# EAGLE schematic esquemático módulo v16 (EAGLE 9.7.0)
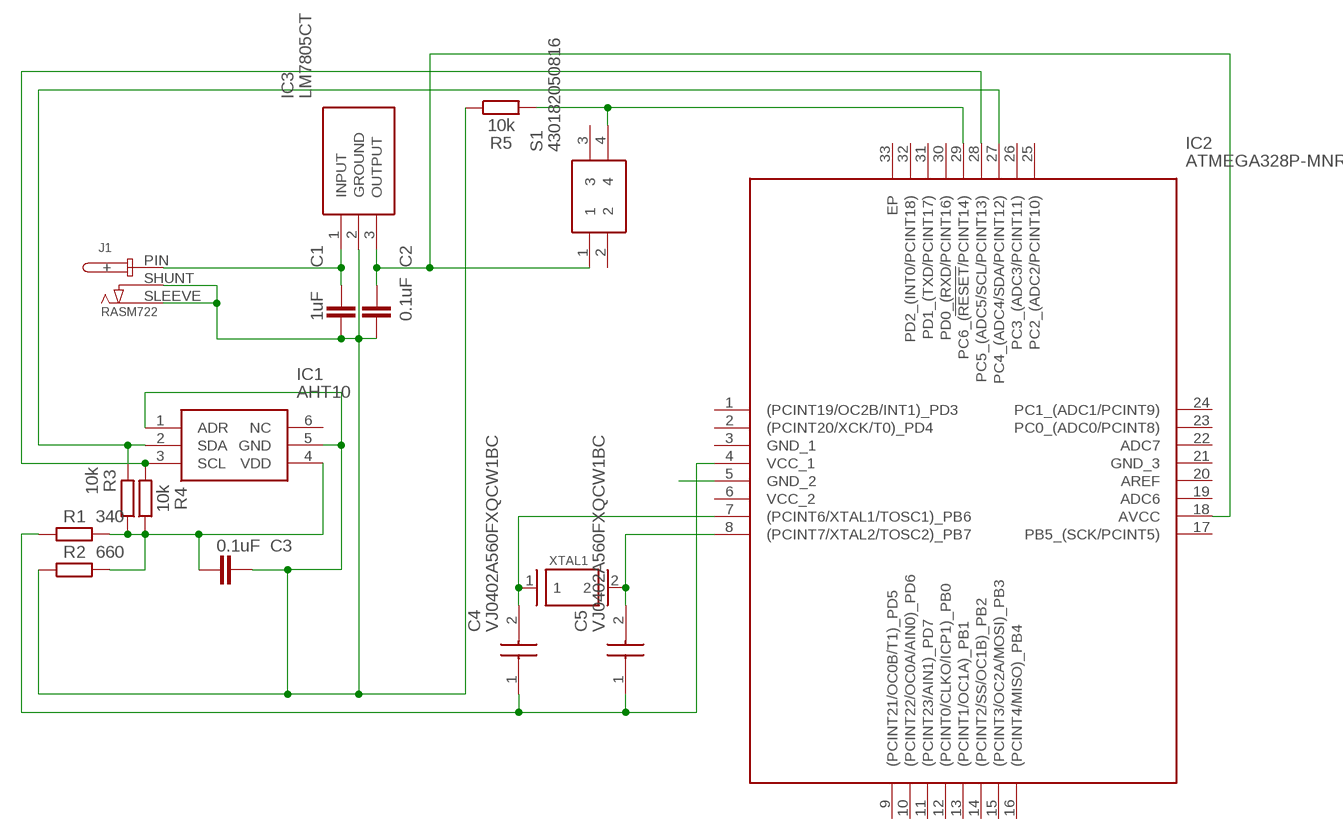
[diagram p0: schematic, sheet 1]

## Parts
C1  1uF  C_CHIP-0402(1005-METRIC)  [CAPC1005X60]
C2  0.1uF  C_CHIP-0402(1005-METRIC)  [CAPC1005X60]
C3  0.1uF  C_CHIP-0402(1005-METRIC)  [CAPC1005X60]
C4  VJ0402A560FXQCW1BC  [CAPC1005X55N]
C5  VJ0402A560FXQCW1BC  [CAPC1005X55N]
IC1  AHT10  [AHT10]
IC2  ATMEGA328P-MNR  [QFN50P500X500X100-33N]
IC3  LM7805CT  [TO254P470X1028X1955-3P]
J1  RASM722  [RASM722X]
R1  340  R_CHIP-2512(6332-METRIC)  [RESC6332X71]
R2  660  R_CHIP-2512(6332-METRIC)  [RESC6332X71]
R3  10k  R_CHIP-2512(6332-METRIC)  [RESC6332X71]
R4  10k  R_CHIP-2512(6332-METRIC)  [RESC6332X71]
R5  10k  R_CHIP-2512(6332-METRIC)  [RESC6332X71]
S1  430182050816  [430182070816]
XTAL1  16MHz  FC4SDFREQUENCY_16MHZ  [XTAL1170X500X450N]

## Nets
GND: C1.2 C2.2 C3.1 IC1.1(ADR) IC1.5(GND) IC3.2(GROUND) J1.SHUNT(-) J1.SLEEVE(NEG) R2.1 R5.1
N$1: IC1.3(SCL) IC2.28(PC5_(ADC5/SCL/PCINT13)) R4.2
N$2: C4.2 IC2.7((PCINT6/XTAL1/TOSC1)_PB6) XTAL1.1
N$3: C3.2 IC1.4(VDD) R1.2 R2.2 R3.1 R4.1
N$4: C5.2 IC2.8((PCINT7/XTAL2/TOSC2)_PB7) XTAL1.2
N$5: C1.1 IC3.1(INPUT) J1.PIN(+)
N$6: IC2.5(GND_2)
N$7: IC1.2(SDA) IC2.27(PC4_(ADC4/SDA/PCINT12)) R3.2
N$9: C2.1 IC2.18(AVCC) IC3.3(OUTPUT) S1.1
N$10: IC2.29(PC6_(!RESET!/PCINT14)) R5.2 S1.4
N$11: C4.1 C5.1 IC2.4(VCC_1) R1.1
Unconnected: IC1.6(NC) IC2.1((PCINT19/OC2B/INT1)_PD3) IC2.2((PCINT20/XCK/T0)_PD4) IC2.3(GND_1) IC2.6(VCC_2) IC2.9((PCINT21/OC0B/T1)_PD5) IC2.10((PCINT22/OC0A/AIN0)_PD6) IC2.11((PCINT23/AIN1)_PD7) IC2.12((PCINT0/CLKO/ICP1)_PB0) IC2.13((PCINT1/OC1A)_PB1) IC2.14((PCINT2/SS/OC1B)_PB2) IC2.15((PCINT3/OC2A/MOSI)_PB3) IC2.16((PCINT4/MISO)_PB4) IC2.17(PB5_(SCK/PCINT5)) IC2.19(ADC6) IC2.20(AREF) IC2.21(GND_3) IC2.22(ADC7) IC2.23(PC0_(ADC0/PCINT8)) IC2.24(PC1_(ADC1/PCINT9)) IC2.25(PC2_(ADC2/PCINT10)) IC2.26(PC3_(ADC3/PCINT11)) IC2.30(PD0_(RXD/PCINT16)) IC2.31(PD1_(TXD/PCINT17)) IC2.32(PD2_(INT0/PCINT18)) IC2.33(EP) S1.2 S1.3

## Library data of the parts
C1-C3 = Capacitor:C: Capacitor - Generic; CATEGORY: Capacitor
C4 C5 = Capacitor:VJ0402A560FXQCW1BC: Multilayer Ceramic Capacitors MLCC - SMD/SMT 0402 56pF 10volts C0G 1% Source: Datasheet <http://www.vishay.com/docs/45226/vj31xrohsautomlcc.pdf>; DESCRIPTION: Multilayer Ceramic Capacitors MLCC - SMD/SMT 0402 56pF 10volts C0G 1%; HEIGHT: 0.55mm; MANUFACTURER_NAME: Vishay; MANUFACTURER_PART_NUMBER: VJ0402A560FXQCW1BC; MOUSER_PART_NUMBER: 77-VJ0402A560FXQCBC; MOUSER_PRICE-STOCK: https://www.mouser.com/Search/Refine.aspx?Keyword=77-VJ0402A560FXQCBC
IC1 = AHT10:AHT10: AHT10 Integrated temperature and humidity sensor Source: Datasheet <https://datasheet.lcsc.com/szlcsc/1901291508_Aosong-Guangzhou-Elec-AHT10_C368909.pdf>; DESCRIPTION: AHT10 Integrated temperature and humidity sensor; HEIGHT: 1.7mm; MANUFACTURER_NAME: Aosong (Guangzhou) Elec; MANUFACTURER_PART_NUMBER: AHT10
IC2 = ATMEGA328P:ATMEGA328P-MNR: 8-bit Microcontrollers - MCU AVR 32K FLSH 2K SRAM 1KB EE-20 MHZ 105C Source: Datasheet <http://ww1.microchip.com/downloads/en/DeviceDoc/ATmega48A-PA-88A-PA-168A-PA-328-P-DS-DS40002061A.pdf>; ARROW_PART_NUMBER: ATMEGA328P-MNR; ARROW_PRICE-STOCK: https://www.arrow.com/en/products/atmega328p-mnr/microchip-technology?region=nac; DESCRIPTION: 8-bit Microcontrollers - MCU AVR 32K FLSH 2K SRAM 1KB EE-20 MHZ 105C; HEIGHT: 1mm; MANUFACTURER_NAME: Microchip; MANUFACTURER_PART_NUMBER: ATMEGA328P-MNR; MOUSER_PART_NUMBER: 556-ATMEGA328P-MNR; MOUSER_PRICE-STOCK: https://www.mouser.co.uk/ProductDetail/Microchip-Technology-Atmel/ATMEGA328P-MNR?qs=6Dg1WZIWLC5fsr6lNbxG3A%3D%3D
IC3 = LM7805CT:LM7805CT: Linear voltage regulator,LM7805CT 5V 1A Source: Datasheet <http://www.ti.com/lit/ds/symlink/lm340.pdf>; ARROW_PART_NUMBER: LM7805CT; ARROW_PRICE-STOCK: https://www.arrow.com/en/products/lm7805ct/texas-instruments; DESCRIPTION: Linear voltage regulator,LM7805CT 5V 1A; HEIGHT: 4.7mm; MANUFACTURER_NAME: Texas Instruments; MANUFACTURER_PART_NUMBER: LM7805CT; MOUSER_PART_NUMBER: 926-LM7805CT; MOUSER_PRICE-STOCK: https://www.mouser.co.uk/ProductDetail/Texas-Instruments/LM7805CT?qs=QbsRYf82W3EaqXeMDVwIfQ%3D%3D
J1 = Connector:RASM722: CONN PWR JACK 2.1X5.5MM SOLDER Manufacturer's datasheet <http://www.switchcraft.com/Documents/EDG4.pdf#page=135>; CREATED_BY: PCBLayout.com; DIGI-KEY_PART_NO: RASM722X-ND; MANUFACTURER: Switchcraft Inc.; MPN: RASM722X
R1-R5 = Resistor:R: Resistor Fixed - Generic; CATEGORY: Resistor; SUB-CATEGORY: Fixed
S1 = button:430182050816: Black Tactile Tactile Switch, NO 50 mA 1.6mm Surface Mount Source: Datasheet <http://katalog.we-online.de/em/datasheet/4301x2xxx8x6.pdf>; DESCRIPTION: Black Tactile Tactile Switch, NO 50 mA 1.6mm Surface Mount; HEIGHT: mm; MANUFACTURER_NAME: Wurth Elektronik; MANUFACTURER_PART_NUMBER: 430182050816; MOUSER_PART_NUMBER: 710-430182050816; MOUSER_PRICE-STOCK: https://www.mouser.co.uk/ProductDetail/Wurth-Elektronik/430182050816?qs=wr8lucFkNMUyle0jQPgWGw%3D%3D
XTAL1 = Frequency-Source:FC4SD: CRYSTAL 8.0000MHZ 20PF SMD 8MHz ±30ppm Crystal 20pF 80 Ohms HC-49/US Datasheet <https://www.foxonline.com/pdfs/C4SD.pdf>; CATEGORY: Resistance Weld; DESCRIPTION: SMD Crystal; FREQUENCY: 16MHZ; MANUFRACTURER: Fox Electronics; MPN: FC4SDCBMF16.0-T1; OPERATING_TEMPERATURE: -20*C to 70*c; PART_STATUS: Active; ROHS_COMPLIANT: COMPLIANT; SERIES: C4SD; SUB_CATEGORY: Resistance Weld SMD Crystal; TOLERANCE: ±30ppm; TYPE: Crystal